# EAGLE design MainBoard_v2.0_RevB (EAGLE 8.4.1)
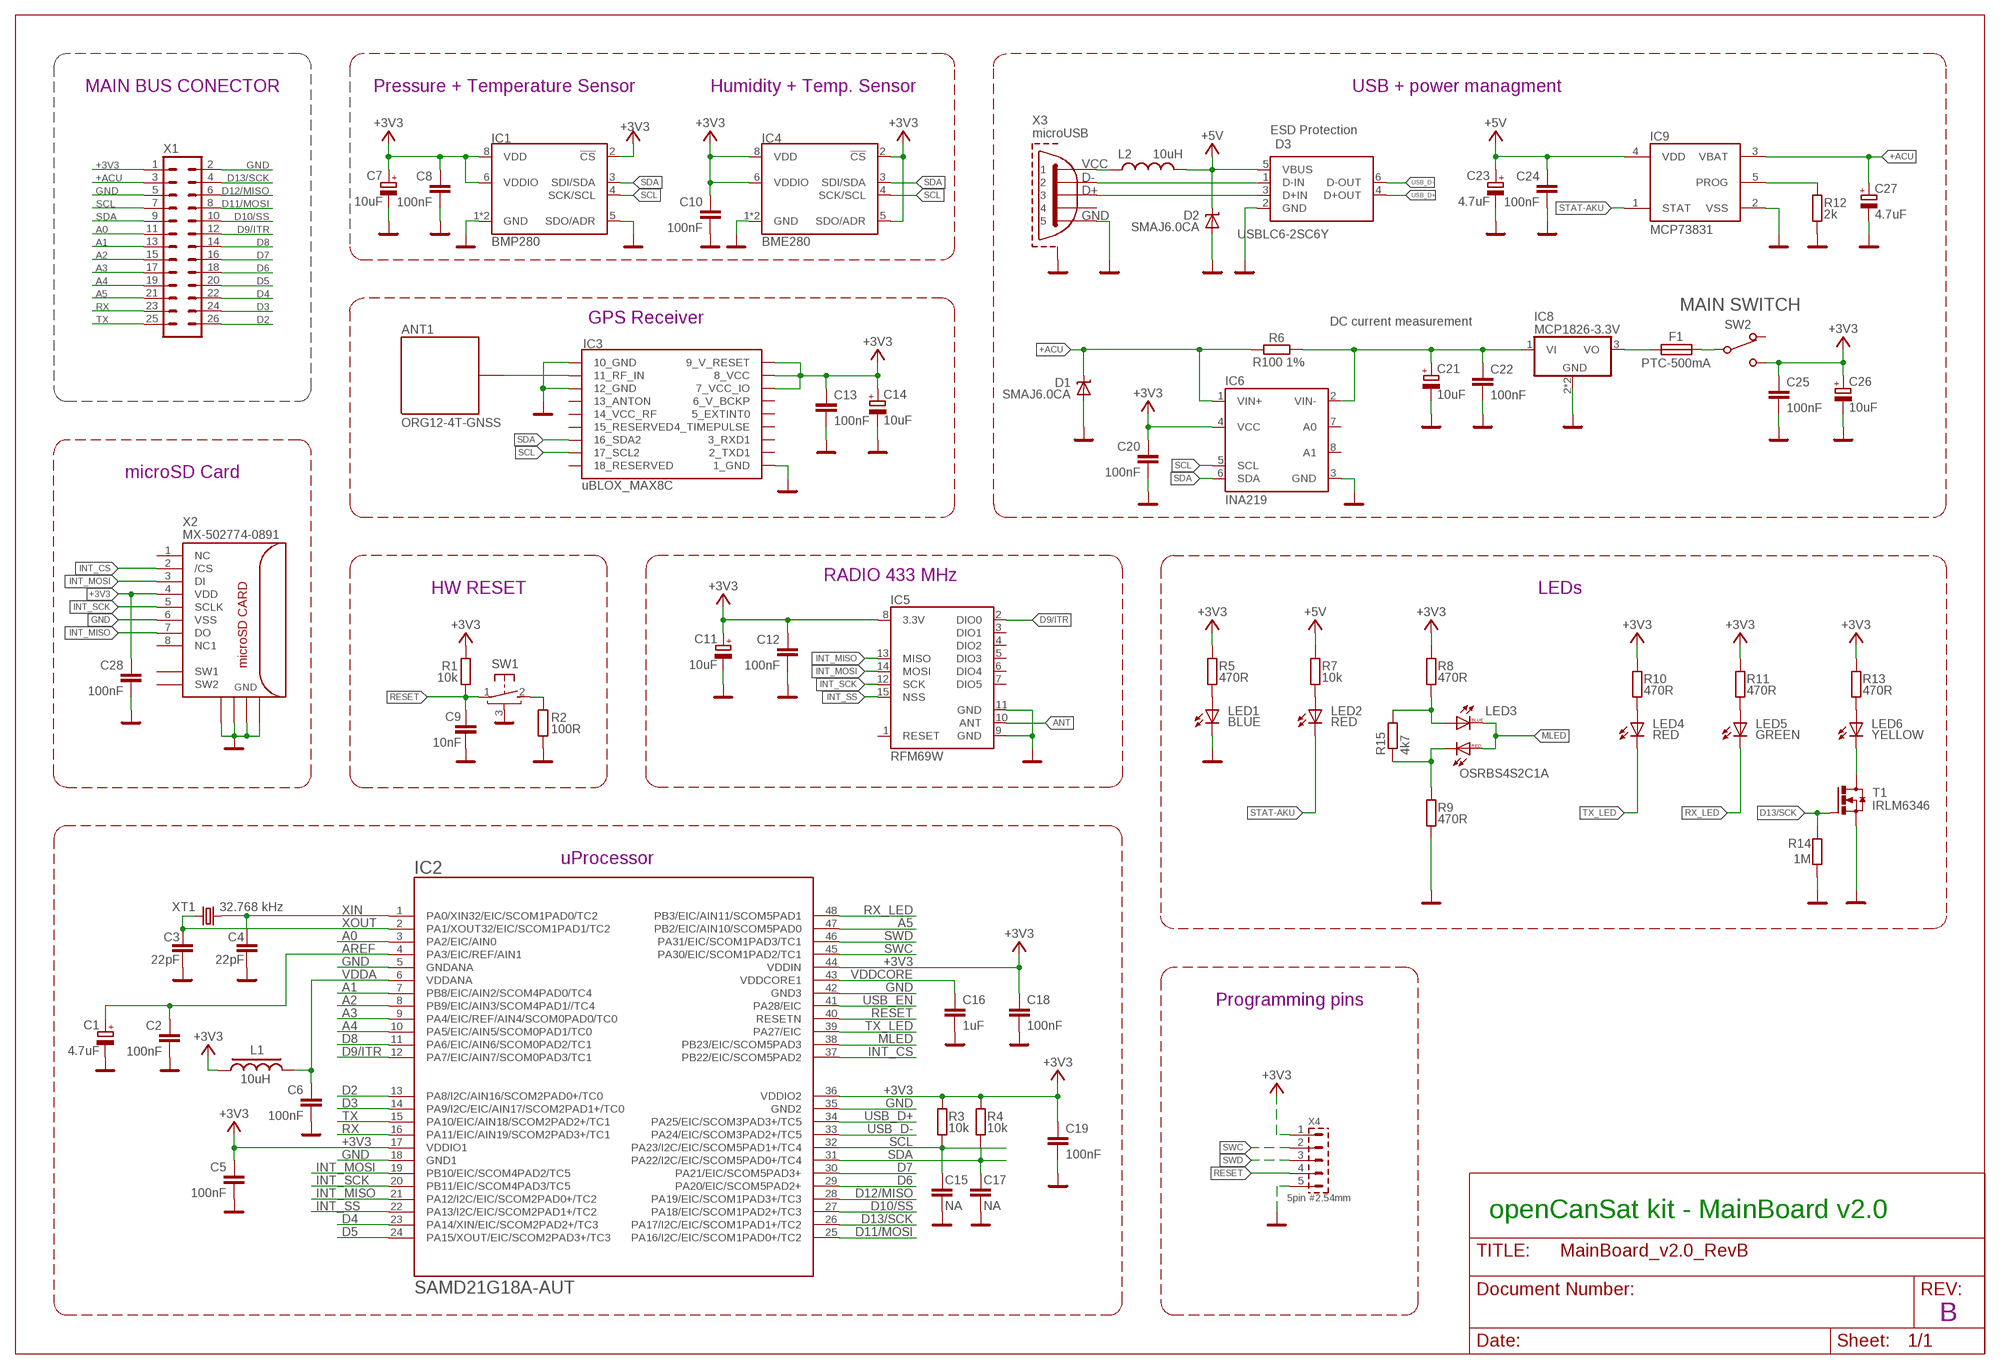
[diagram p0: schematic, sheet 1]

## Parts
ANT1  ORG12-4T-GNSS  GPS_ANT  [ANT_GPS_12X12]
C1  4.7uF  CPOL-EUSMCA  [SMC_A]
C2  100nF  C-EUC0603  [C0603]
C3  22pF  C-EUC0603  [C0603]
C4  22pF  C-EUC0603  [C0603]
C5  100nF  C-EUC0603  [C0603]
C6  100nF  C-EUC0603  [C0603]
C7  10uF  CPOL-EUSMCA  [SMC_A]
C8  100nF  C-EUC0603  [C0603]
C9  10nF  C-EUC0603  [C0603]
C10  100nF  C-EUC0603  [C0603]
C11  10uF  CPOL-EUSMCA  [SMC_A]
C12  100nF  C-EUC0603  [C0603]
C13  100nF  C-EUC0603  [C0603]
C14  10uF  CPOL-EUSMCA  [SMC_A]
C15  NA  C-EUC0603  [C0603]
C16  1uF  C-EUC0805  [C0805]
C17  NA  C-EUC0603  [C0603]
C18  100nF  C-EUC0603  [C0603]
C19  100nF  C-EUC0603  [C0603]
C20  100nF  C-EUC0603  [C0603]
C21  10uF  CPOL-EUSMCB  [SMC_B]
C22  100nF  C-EUC0603  [C0603]
C23  4.7uF  CPOL-EUSMCA  [SMC_A]
C24  100nF  C-EUC0603  [C0603]
C25  100nF  C-EUC0603  [C0603]
C26  10uF  CPOL-EUSMCB  [SMC_B]
C27  4.7uF  CPOL-EUSMCA  [SMC_A]
C28  100nF  C-EUC0603  [C0603]
D1  SMAJ6.0CA  TRANSILDO214AC  [DO214AC]
D2  SMAJ6.0CA  TRANSILDO214AC  [DO214AC]
D3  USBLC6-2SC6Y  [SOT95P280X145-6N]
F1  PTC-500mA  FUZE1210  [1210]
IC1  BMP280  BME280  [LGA-8-2.5X2.5]
IC2  SAMD21G18A-AUT  1792_SAMD21G18A-AUT  [TQFP48-7X7]
IC3  uBLOX_MAX8C  UBLOX_MAX-6  [UBLOX_MAX-6]
IC4  BME280  [LGA-8-2.5X2.5]
IC5  RFM69W  RFM69HW  [RFM69W-XXXS2]
IC6  INA219  [SOT23-8]
IC8  MCP1826-3.3V  MCP1826SOT223-3  [SOT223-3]
IC9  MCP73831  MCP73831/OT  [SOT23-5L]
L1  10uH  L-USL0805  [R0805]
L2  10uH  L-USL0805  [R0805]
LED1  BLUE  LEDCHIPLED_0603  [CHIPLED_0603]
LED2  RED  LEDCHIPLED_0603  [CHIPLED_0603]
LED3  OSRBS4S2C1A  [PLCC4]
LED4  RED  LEDCHIPLED_0603  [CHIPLED_0603]
LED5  GREEN  LEDCHIPLED_0603  [CHIPLED_0603]
LED6  YELLOW  LEDCHIPLED_0603  [CHIPLED_0603]
R1  10k  R-EU_R0603  [R0603]
R2  100R  R-EU_R0603  [R0603]
R3  10k  R-EU_R0603  [R0603]
R4  10k  R-EU_R0603  [R0603]
R5  470R  R-EU_R0603  [R0603]
R6  R100 1%  R-EU_R2010  [R2010]
R7  10k  R-EU_R0603  [R0603]
R8  470R  R-EU_R0603  [R0603]
R9  470R  R-EU_R0603  [R0603]
R10  470R  R-EU_R0603  [R0603]
R11  470R  R-EU_R0603  [R0603]
R12  2k  R-EU_R0603  [R0603]
R13  470R  R-EU_R0603  [R0603]
R14  1M  R-EU_R0603  [R0603]
R15  4k7  R-EU_R0603  [R0603]
SW1  B3U-3100P  [B3U-3100PM]
SW2  MSS-1290  [MSS-1290]
T1  IRLM6346  IRLML6346  [SOT23]
X1  MA13-2SMD  [MA13-2]
X2  MX-502774-0891  MICROSD  [502774-0891]
X3  microUSB  MICROUSB1981568  [1981568-MICROUSB]
X4  5pin #2.54mm  S1G5_JUMPSMD  [PIN5]
XT1  32.768 kHz  XTAL32KHZ  [XTAL35X15]

## Nets
3V31: F1.P$1 IC8.3(VO)
3V32: F1.P$2 SW2.2(2-COM)
+3V3: C5.1 C7.+ C8.1 C10.1 C11.+ C12.1 C13.1 C14.+ C18.1 C19.1 C20.1 C25.1 C26.+ C28.1 IC1.2(!CS) IC1.6(VDDIO) IC1.8(VDD) IC2.17(VDDIO1) IC2.36(VDDIO2) IC2.44(VDDIN) IC3.7_VCC_IO IC3.8_VCC IC3.9_V_RESET IC4.2(!CS) IC4.5(SDO/ADR) IC4.6(VDDIO) IC4.8(VDD) IC5.8(3.3V) IC6.4(VCC) L1.1 R1.2 R3.2 R4.2 R5.2 R8.2 R10.2 R11.2 R13.2 SW2.1(1-NO) X1.1 X2.4(VDD) X4.1
+5V: C23.+ C24.1 D2.C D3.5(VBUS) IC9.4(VDD) L2.2 R7.2
+ACU: C27.+ D1.C IC6.1(VIN+) IC9.3(VBAT) R6.1 X1.3
+VUSB: L2.1 X3.P$1
A0: IC2.3(PA2/EIC/AIN0) X1.11
A1: IC2.7(PB8/EIC/AIN2/SCOM4PAD0/TC4) X1.13
A2: IC2.8(PB9/EIC/AIN3/SCOM4PAD1//TC4) X1.15
A3: IC2.9(PA4/EIC/REF/AIN4/SCOM0PAD0/TC0) X1.17
A4: IC2.10(PA5/EIC/AIN5/SCOM0PAD1/TC0) X1.19
A5: IC2.47(PB2/EIC/AIN10/SCOM5PAD0) X1.21
ANT: IC5.10(ANT)
ANT_GPS: ANT1.ANT_GPS IC3.11_RF_IN
AREF: C1.+ C2.1 IC2.4(PA3/EIC/REF/AIN1)
D2: IC2.13(PA8/I2C/AIN16/SCOM2PAD0+/TC0) X1.26
D3: IC2.14(PA9/I2C/EIC/AIN17/SCOM2PAD1+/TC0) X1.24
D4: IC2.23(PA14/XIN/EIC/SCOM2PAD2+/TC3) X1.22
D5: IC2.24(PA15/XOUT/EIC/SCOM2PAD3+/TC3) X1.20
D6: IC2.29(PA20/EIC/SCOM5PAD2+) X1.18
D7: IC2.30(PA21/EIC/SCOM5PAD3+) X1.16
D8: IC2.11(PA6/EIC/AIN6/SCOM0PAD2/TC1) X1.14
D9/ITR: IC2.12(PA7/EIC/AIN7/SCOM0PAD3/TC1) IC5.2(DIO0) X1.12
D10/SS: IC2.27(PA18/EIC/SCOM1PAD2+/TC3) X1.10
D11/MOSI: IC2.25(PA16/I2C/EIC/SCOM1PAD0+/TC2) X1.8
D12/MISO: IC2.28(PA19/EIC/SCOM1PAD3+/TC3) X1.6
D13/SCK: IC2.26(PA17/I2C/EIC/SCOM1PAD1+/TC2) R14.2 T1.1(G) X1.4
D+IN: D3.3(D+IN) X3.P$3
D-IN: D3.1(D-IN) X3.P$2
GND: C1.- C2.2 C3.2 C4.2 C5.2 C6.2 C7.- C8.2 C9.2 C10.2 C11.- C12.2 C13.2 C14.- C15.2 C16.2 C17.2 C18.2 C19.2 C20.2 C21.- C22.2 C23.- C24.2 C25.2 C26.- C27.- C28.2 D1.A D2.A D3.2(GND) IC1.1(GND) IC1.5(SDO/ADR) IC1.7(GND) IC2.5(GNDANA) IC2.18(GND1) IC2.35(GND2) IC2.42(GND3) IC3.1_GND IC3.10_GND IC3.12_GND IC4.1(GND) IC4.7(GND) IC5.9(GND) IC5.11(GND) IC6.3(GND) IC8.2(GND) IC8.4(GND) IC9.2(VSS) LED1.C R2.1 R9.1 R12.1 R14.1 SW1.3 T1.2(S) X1.2 X1.5 X2.6(VSS) X2.GND1 X2.GND2 X2.GND3 X2.GND4 X3.P$5 X3.P$6(SHIELD) X3.P$7(SHIELD) X3.P$8(SHIELD) X3.P$9(SHIELD) X3.P$10(SHIELD) X3.P$11(SHIELD) X4.5
INT_CS: IC2.37(PB22/EIC/SCOM5PAD2) X2.2(/CS)
INT_MISO: IC2.21(PA12/I2C/EIC/SCOM2PAD0+/TC2) IC5.13(MISO) X2.7(DO)
INT_MOSI: IC2.19(PB10/EIC/SCOM4PAD2/TC5) IC5.14(MOSI) X2.3(DI)
INT_SCK: IC2.20(PB11/EIC/SCOM4PAD3/TC5) IC5.12(SCK) X2.5(SCLK)
INT_SS: IC2.22(PA13/I2C/EIC/SCOM2PAD1+/TC2) IC5.15(NSS)
MLED: IC2.38(PB23/EIC/SCOM5PAD3) LED3.3(C-B) LED3.4(A-R)
N$1: LED4.A R10.1
N$2: LED5.A R11.1
N$3: LED6.A R13.1
N$5: LED6.C T1.3(D)
N$6: R2.2 SW1.2(S)
N$7: LED3.2(A-B) R8.1 R15.2
N$9: LED3.1(C-R) R9.2 R15.1
N$11: LED2.A R7.1
N$13: LED1.A R5.1
N$14: C21.+ C22.1 IC6.2(VIN-) IC8.1(VI) R6.2
N$16: IC9.5(PROG) R12.2
RESET: C9.1 IC2.40(RESETN) R1.1 SW1.1(P) X4.4
RX: IC2.16(PA11/EIC/AIN19/SCOM2PAD3+/TC1) X1.23
RX_LED: IC2.48(PB3/EIC/AIN11/SCOM5PAD1) LED5.C
SCL: C15.1 IC1.4(SCK/SCL) IC2.32(PA23/I2C/EIC/SCOM5PAD1+/TC4) IC3.17_SCL2 IC4.4(SCK/SCL) IC6.5(SCL) R3.1 X1.7
SDA: C17.1 IC1.3(SDI/SDA) IC2.31(PA22/I2C/EIC/SCOM5PAD0+/TC4) IC3.16_SDA2 IC4.3(SDI/SDA) IC6.6(SDA) R4.1 X1.9
STAT-AKU: IC9.1(STAT) LED2.C
SWC: IC2.45(PA30/EIC/SCOM1PAD2/TC1) X4.2
SWD: IC2.46(PA31/EIC/SCOM1PAD3/TC1) X4.3
TX: IC2.15(PA10/EIC/AIN18/SCOM2PAD2+/TC1) X1.25
TX_LED: IC2.39(PA27/EIC) LED4.C
USB_D+: D3.4(D+OUT) IC2.34(PA25/EIC/SCOM3PAD3+/TC5)
USB_D-: D3.6(D-OUT) IC2.33(PA24/EIC/SCOM3PAD2+/TC5)
USB_EN: IC2.41(PA28/EIC)
VDDA: C6.1 IC2.6(VDDANA) L1.2
VDDCORE: C16.1 IC2.43(VDDCORE1)
XIN: C4.1 IC2.1(PA0/XIN32/EIC/SCOM1PAD0/TC2) XT1.2
XOUT: C3.1 IC2.2(PA1/XOUT32/EIC/SCOM1PAD1/TC2) XT1.1
Unconnected: IC3.2_TXD1 IC3.3_RXD1 IC3.4_TIMEPULSE IC3.5_EXTINT0 IC3.6_V_BCKP IC3.13_ANTON IC3.14_VCC_RF IC3.15_RESERVED IC3.18_RESERVED IC5.1(RESET) IC5.3(DIO1) IC5.4(DIO2) IC5.5(DIO3) IC5.6(DIO4) IC5.7(DIO5) IC6.7(A0) IC6.8(A1) SW2.3(3-NC) X2.1(NC) X2.8(NC1) X2.SW1 X2.SW2 X3.P$4

## Notes on the sheet
- MAIN BUS CONECTOR | Pressure + Temperature Sensor | Humidity + Temp. Sensor | USB + power managment
- ESD Protection
- MAIN SWITCH
- GPS Receiver | DC current measurement
- microSD Card
- RADIO 433 MHz
- HW RESET | LEDs
- uProcessor
- Programming pins
- openCanSat kit - MainBoard v2.0
- B

## Library data of the parts
ANT1 = #my:GPS_ANT
C1 C7 C11 C14 C21 C23 C26 C27 = rcl:CPOL-EU: POLARIZED CAPACITOR, European symbol
C2-C6 C8-C10 C12 C13 C15-C20 C22 C24 C25 C28 = rcl:C-EU: CAPACITOR, European symbol
D1 D2 = #Marek:TRANSIL: TRANSIL
D3 = USBLC6-2SC6Y:USBLC6-2SC6Y: Low Cap. ESD Protection Auto SOT-23-6 STMicroelectronics USBLC6-2SC6Y, Dual Uni-Directional TVS Diode Array, 6-Pin SOT-23 <https://componentsearchengine.com/Images/1/USBLC6-2SC6Y.jpg> Source: Datasheet <https://componentsearchengine.com/Datasheets/1/USBLC6-2SC6Y.pdf>; DESCRIPTION: Low Cap. ESD Protection Auto SOT-23-6 STMicroelectronics USBLC6-2SC6Y, Dual Uni-Directional TVS Diode Array, 6-Pin SOT-23; HEIGHT: 1.45mm; MANUFACTURER_NAME: STMicroelectronics; MANUFACTURER_PART_NUMBER: USBLC6-2SC6Y; RS_PART_NUMBER: 8805525; SUPPLIER_NAME: RS
F1 = #littlefuse:FUZE1210: KufMic
IC1 = SparkFun-Sensors:BME280: Bosch BME280 – Combined Humidity and Pressure Sensor The BME280 is as combined digital humidity, pressure and temperature sensor based on proven sensing principles. The sensor module is housed in an extremely compact metal-lid LGA package with a footprint of only 2.5×2.5mm² with a height of 0.93mm. Its small dimensions and its low power consumption allow the implementation in battery driven devices such as handsets, GPS modules or watches. Datasheet <https://cdn.sparkfun.com/assets/learn_tutorials/4/1/9/BST-BME280_DS001-10.pdf> SparkFun Products SparkFun Atmospheric Sensor Breakout - BME280 <https://www.sparkfun.com/products/13676> (SEN-13676); PROD_ID: IC-13090; VALUE: BME280
IC2 = IntegratedCircuits:1792_SAMD21G18A-AUT: Atmel D21 32bit ARM Cortex-M0 microcontroller - 48 PIN TQFP 256KB flash memory + 32KB SRAM
IC3 = ava:UBLOX_MAX-6: UBLOX MAX-6
IC4 = SparkFun-Sensors:BME280: Bosch BME280 – Combined Humidity and Pressure Sensor The BME280 is as combined digital humidity, pressure and temperature sensor based on proven sensing principles. The sensor module is housed in an extremely compact metal-lid LGA package with a footprint of only 2.5×2.5mm² with a height of 0.93mm. Its small dimensions and its low power consumption allow the implementation in battery driven devices such as handsets, GPS modules or watches. Datasheet <https://cdn.sparkfun.com/assets/learn_tutorials/4/1/9/BST-BME280_DS001-10.pdf> SparkFun Products SparkFun Atmospheric Sensor Breakout - BME280 <https://www.sparkfun.com/products/13676> (SEN-13676); PROD_ID: IC-13090
IC5 = SparkFun-RF:RFM69H: Hope RF RFM69H ISM Transceiver Module The RFM69H is a transceiver module capable of operation over a wide frequency range, including the 315,433,868 and 915MHz license-free ISM (Industry Scientific and Medical) frequency bands. All major RF communication parameters are programmable and most of them can be dynamically set. The RFM69H offers the unique advantage of programmable narrow-band and wide- band communication modes. The RFM69H is optimized for low power consumption while offering high RF output power and channelized operation.Compliance ETSI and FCC regulations. Datasheet <http://www.hoperf.cn/upload/docs/RF/SX/RFM69H_DataSheet_v1.3.pdf> SparkFun Products RFM69HCW Wireless Transceiver - 915MHz <https://www.sparkfun.com/products/13909> (COM-13909) RFM69HCW Wireless Transceiver - 434MHz <https://www.sparkfun.com/products/13910> (COM-13910) SparkFun RFM69 Breakout (915MHz) <https://www.sparkfun.com/products/12775> (WRL-12775) SparkFun RFM69 Breakout (434MHz) <https://www.sparkfun.com/products/12823> (WRL-12823)
IC6 = #my:INA219
IC8 = #Microchip:MCP1826
IC9 = adafruit:MCP73831: MCP73831/2 Miniature Single-Cell, Fully Integrated Li-Ion, Li-Polymer Charge Management Controllers. Nice and small simple lipoly charge controller, with adjustable current and status output (LED) http://www.ladyada.net/library/pcb/eaglelibrary.html
L1 L2 = rcl:L-US: INDUCTOR, American symbol
LED1 LED2 LED4-LED6 = led:LED: LED OSRAM: - CHIPLED LG R971, LG N971, LY N971, LG Q971, LY Q971, LO R971, LY R971 LH N974, LH R974 LS Q976, LO Q976, LY Q976 LO Q996 - Hyper CHIPLED LW Q18S LB Q993, LB Q99A, LB R99A - SideLED LS A670, LO A670, LY A670, LG A670, LP A670 LB A673, LV A673, LT A673, LW A673 LH A674 LY A675 LS A676, LA A676, LO A676, LY A676, LW A676 LS A679, LY A679, LG A679 - Hyper Micro SIDELED® LS Y876, LA Y876, LO Y876, LY Y876 LT Y87S - SmartLED LW L88C, LW L88S LB L89C, LB L89S, LG L890 LS L89K, LO L89K, LY L89K LS L896, LA L896, LO L896, LY L896 - TOPLED LS T670, LO T670, LY T670, LG T670, LP T670 LSG T670, LSP T670, LSY T670, LOP T670, LYG T670 LG T671, LOG T671, LSG T671 LB T673, LV T673, LT T673, LW T673 LH T674 LS T676, LA T676, LO T676, LY T676, LB T676, LH T676, LSB T676, LW T676 LB T67C, LV T67C, LT T67C, LS T67K, LO T67K, LY T67K, LW E67C LS E67B, LA E67B, LO E67B, LY E67B, LB E67C, LV E67C, LT E67C LW T67C LS T679, LY T679, LG T679 LS T770, LO T770, LY T770, LG T770, LP T770 LB T773, LV T773, LT T773, LW T773 LH T774 LS E675, LA E675, LY E675, LS T675 LS T776, LA T776, LO T776, LY T776, LB T776 LHGB T686 LT T68C, LB T68C - Hyper Mini TOPLED® LB M676 - Mini TOPLED Santana® LG M470 LS M47K, LO M47K, LY M47K Source: http://www.osram.convergy.de LUXEON: - LUMILED® LXK2-PW12-R00, LXK2-PW12-S00, LXK2-PW14-U00, LXK2-PW14-V00 LXK2-PM12-R00, LXK2-PM12-S00, LXK2-PM14-U00 LXK2-PE12-Q00, LXK2-PE12-R00, LXK2-PE12-S00, LXK2-PE14-T00, LXK2-PE14-U00 LXK2-PB12-K00, LXK2-PB12-L00, LXK2-PB12-M00, LXK2-PB14-N00, LXK2-PB14-P00, LXK2-PB14-Q00 LXK2-PR12-L00, LXK2-PR12-M00, LXK2-PR14-Q00, LXK2-PR14-R00 LXK2-PD12-Q00, LXK2-PD12-R00, LXK2-PD12-S00 LXK2-PH12-R00, LXK2-PH12-S00 LXK2-PL12-P00, LXK2-PL12-Q00, LXK2-PL12-R00 Source: www.luxeon.com KINGBRIGHT: KA-3528ASYC Source: www.kingbright.com
LED3 = led:OSRBS4S2C1A
R1-R15 = rcl:R-EU_: RESISTOR, European symbol
SW1 = #my:B3U-3100P
SW2 = #PaJa_prepinace:MSS-1290: MSS-1290BN (TME)
T1 = #my:IRLML6346
X1 = #my:MA13-2
X2 = con-molex-microsd:MICROSD
X3 = #Marek:MICROUSB
X4 = #PaJa_konektory:S1G5_JUMP: Radove konektory - koliky - 5x
XT1 = #my:XTAL32KHZ

## Net classes
1 USB: width 0.203 mm, drill 0.305 mm, clearance 0.178 mm
2 gnd: width 0.254 mm, drill 0.254 mm, clearance 0.178 mm
3 usbvcc: width 0.203 mm, drill 0.406 mm, clearance 0.178 mm
4 USBpair: width 0.254 mm, drill 0.406 mm, clearance 0.406 mm

## Board
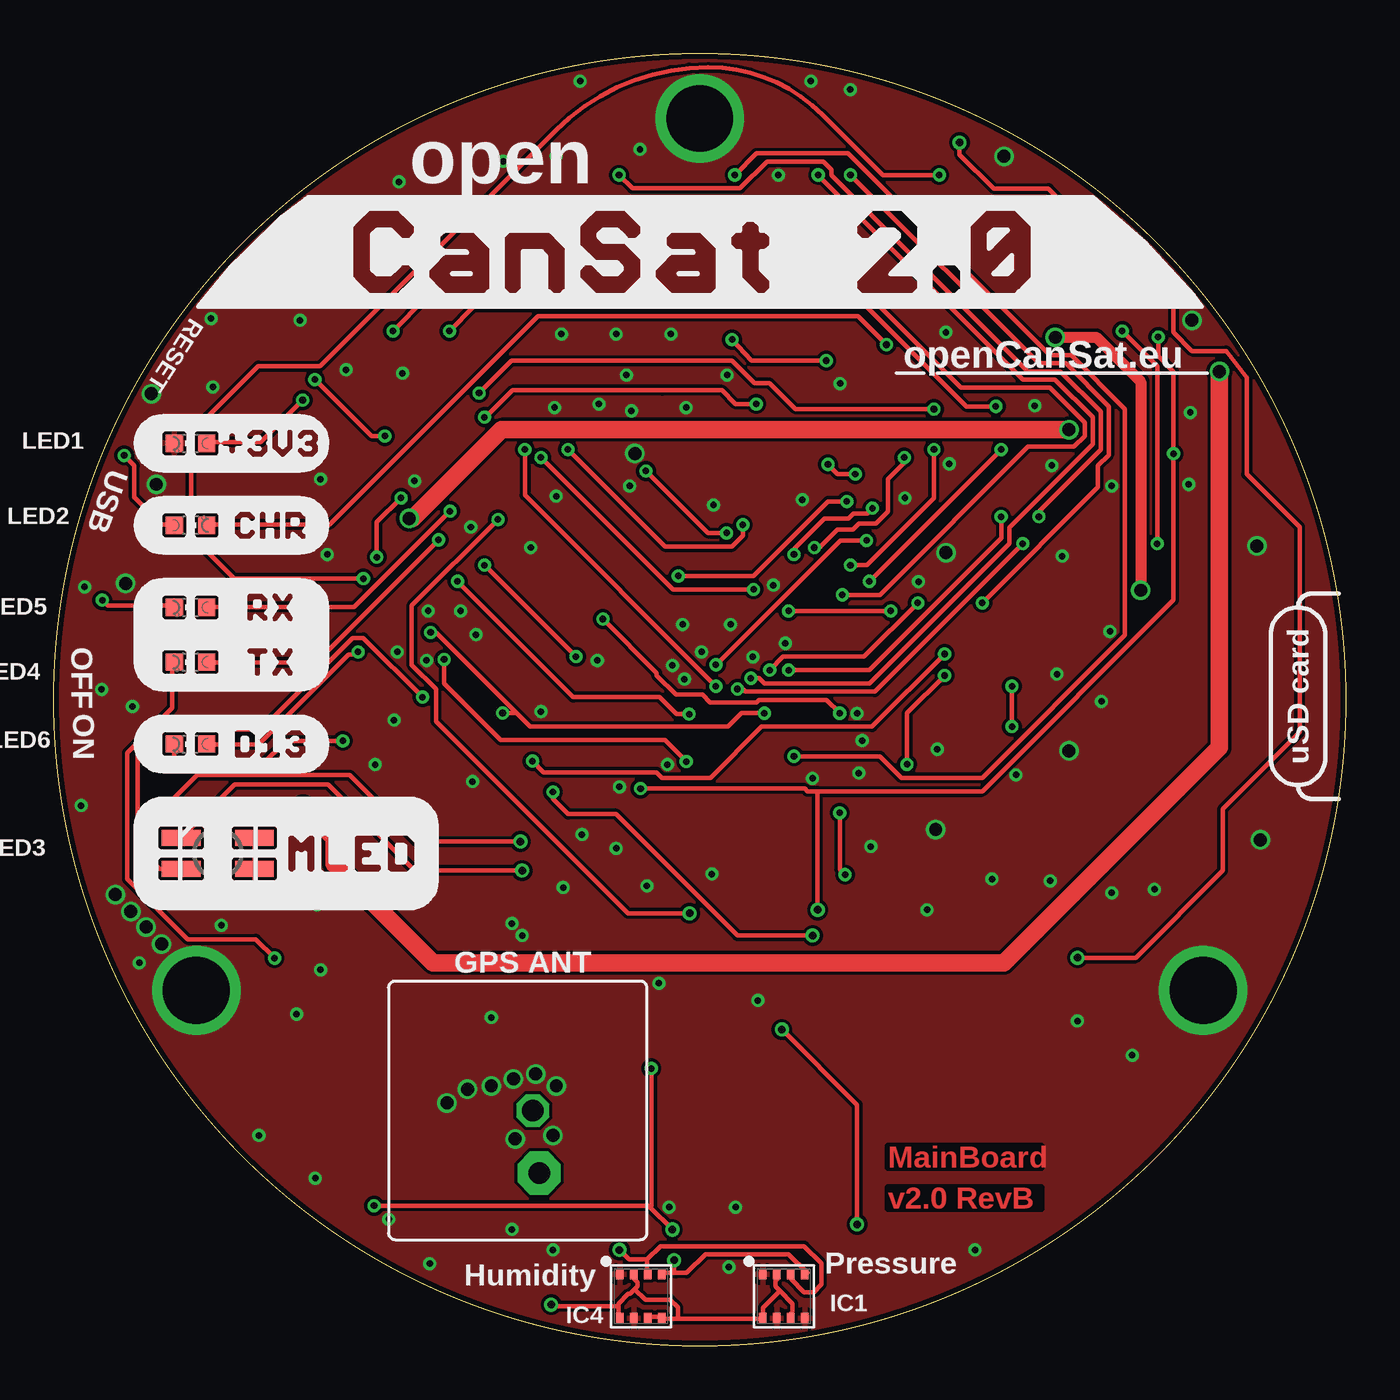
[diagram p1: board, top side]
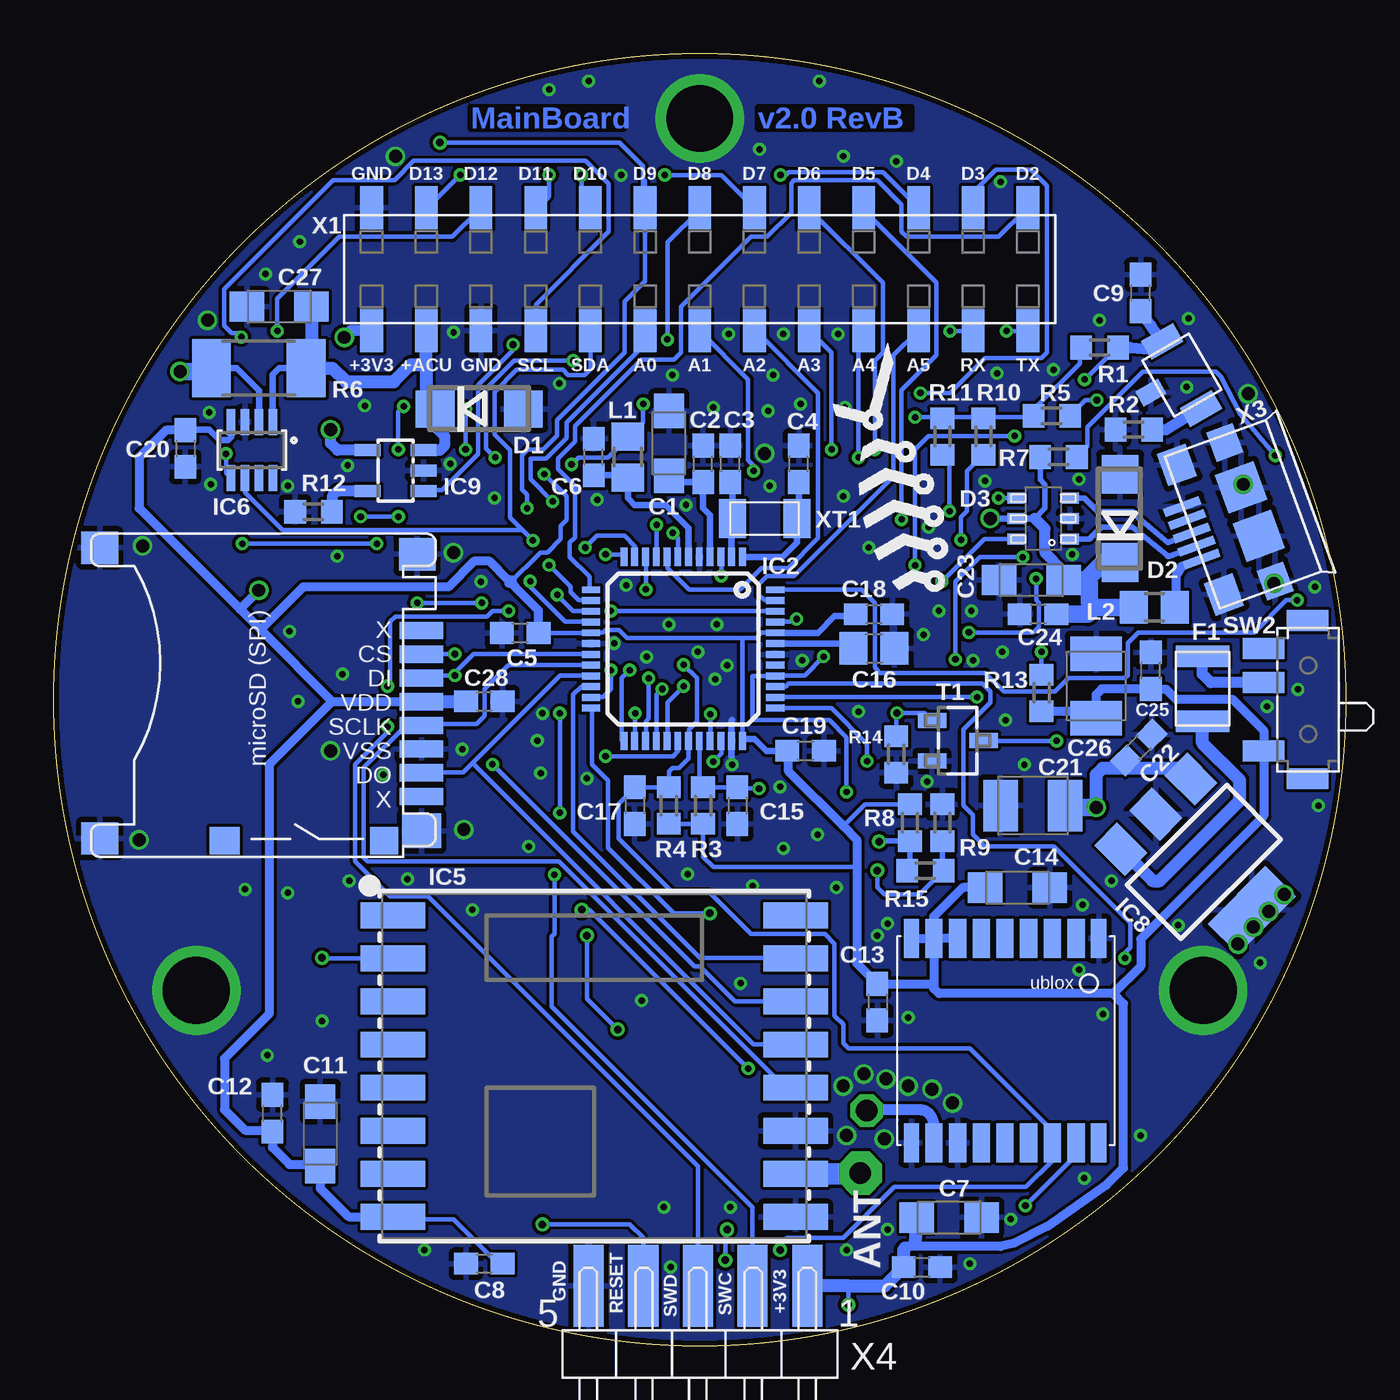
[diagram p2: board, bottom side, seen from below]

Size 60 x 60 mm. Coordinates in mm from the lower left corner, seen from the top.
Outline: circle at 30,30 radius 30
Copper layers (1*16): Top 0.035mm / dielectric 1.5mm / Bottom 0.035mm
Design rules "SeeedStudio_2layer_DRU_no_angle_20140221 *": minimum track width 8mil, minimum drill 0.3mm, track to track 6mil, track to pad 6mil, pad to pad 6mil, via to via 6mil, smd to smd 0mil, copper to edge 10mil, drill to drill 10mil, minimum pad ring 10mil, minimum via ring 6mil, stop-mask expansion 2mil, vias tented up to drill 100mil, thermal gap 10mil
vRestrict: area 4.4,47.6 to 55.2,54; area 3.5,40.3 to 13,43.5; area 3.5,36.5 to 13,39.7; area 3.5,30.2 to 13,35.9; area 3.5,26.4 to 13,29.5; area 3.5,20 to 18.1,25.7

### Footprints (pad centres in the part's own frame; a part is rotated, then mirrored left to right if it is on the bottom)
ANT_GPS_12X12 = drill 1 octagon: ANT_GPS 0,-0.7
SMC_A = smd 1.6 x 1.4: + -1.5,0; - 1.5,0
C0603 = smd 1.1 x 1: 1 -0.85,0; 2 0.85,0
C0805 = smd 1.3 x 1.5: 1 -0.95,0; 2 0.95,0
SMC_B = smd 1.6 x 2.4: + -1.5,0; - 1.5,0
DO214AC = smd 1.8 x 1.7: A 2.05,0; C -2.05,0
SOT95P280X145-6N = smd 0.813 x 0.508: 1 -1.25,0.95; 2 -1.25,0; 3 -1.25,-0.95; 4 1.25,-0.95; 5 1.25,0; 6 1.25,0.95
1210 = smd 1 x 2.5: P$1 -1.47,-0.02; P$2 1.53,-0.02
LGA-8-2.5X2.5 = smd 0.35 x 0.5: 1 -0.975,1.025; 2 -0.325,1.025; 3 0.325,1.025; 4 0.975,1.025; 5 0.975,-1.025; 6 0.325,-1.025; 7 -0.325,-1.025; 8 -0.975,-1.025
TQFP48-7X7 = smd 0.85 x 0.32: 1 -4.275,2.75; 2 -4.275,2.25; 3 -4.275,1.75; 4 -4.275,1.25; 5 -4.275,0.75; 6 -4.275,0.25; 7 -4.275,-0.25; 8 -4.275,-0.75; 9 -4.275,-1.25; 10 -4.275,-1.75; 11 -4.275,-2.25; 12 -4.275,-2.75; 25 4.275,-2.75; 26 4.275,-2.25; 27 4.275,-1.75; 28 4.275,-1.25; 29 4.275,-0.75; 30 4.275,-0.25; 31 4.275,0.25; 32 4.275,0.75; 33 4.275,1.25; 34 4.275,1.75; 35 4.275,2.25; 36 4.275,2.75 | smd 0.32 x 0.85: 13 -2.75,-4.275; 14 -2.25,-4.275; 15 -1.75,-4.275; 16 -1.25,-4.275; 17 -0.75,-4.275; 18 -0.25,-4.275; 19 0.25,-4.275; 20 0.75,-4.275; 21 1.25,-4.275; 22 1.75,-4.275; 23 2.25,-4.275; 24 2.75,-4.275; 37 2.75,4.275; 38 2.25,4.275; 39 1.75,4.275; 40 1.25,4.275; 41 0.75,4.275; 42 0.25,4.275; 43 -0.25,4.275; 44 -0.75,4.275; 45 -1.25,4.275; 46 -1.75,4.275; 47 -2.25,4.275; 48 -2.75,4.275
UBLOX_MAX-6 = smd 1.8 x 0.7: 1_GND 4.95,-4.4; 9_V_RESET 4.95,4.3; 10_GND -4.55,4.3; 18_RESERVED -4.55,-4.4 | smd 1.8 x 0.8: 2_TXD1 4.95,-3.35; 3_RXD1 4.95,-2.25; 4_TIMEPULSE 4.95,-1.15; 5_EXTINT0 4.95,-0.05; 6_V_BCKP 4.95,1.05; 7_VCC_IO 4.95,2.15; 8_VCC 4.95,3.25; 11_RF_IN -4.55,3.25; 12_GND -4.55,2.15; 13_ANTON -4.55,1.05; 14_VCC_RF -4.55,-0.05; 15_RESERVED -4.55,-1.15; 16_SDA2 -4.55,-2.25; 17_SCL2 -4.55,-3.35
RFM69W-XXXS2 = smd 3 x 1.2: 1 -9.35,7; 2 -9.35,5; 3 -9.35,3; 4 -9.35,1; 5 -9.35,-1; 6 -9.35,-3; 7 -9.35,-5; 8 -9.35,-7; 9 9.35,-7; 10 9.35,-5; 11 9.35,-3; 12 9.35,-1; 13 9.35,1; 14 9.35,3; 15 9.35,5; 16 9.35,7
SOT23-8 = smd 0.4 x 1.2: 1 -0.975,-1.3; 2 -0.325,-1.3; 3 0.325,-1.3; 4 0.975,-1.3; 5 0.975,1.3; 6 0.325,1.3; 7 -0.325,1.3; 8 -0.975,1.3
SOT223-3 = smd 1.5 x 2: 1 -2.3,-3.15; 2 0,-3.15; 3 2.3,-3.15 | smd 3.8 x 2: 4 0,3.15
SOT23-5L = smd 0.55 x 1.2: 1 -0.95,-1.3; 2 0,-1.3; 3 0.95,-1.3; 4 0.95,1.3; 5 -0.95,1.3
R0805 = smd 1.3 x 1.5: 1 -0.95,0; 2 0.95,0
CHIPLED_0603 = smd 0.8 x 0.8: A 0,-0.75; C 0,0.75
PLCC4 = smd 0.75 x 1.8: 1 0.725,1.7; 2 -0.725,1.7; 3 -0.725,-1.7; 4 0.725,-1.7
R0603 = smd 1 x 1.1: 1 -0.85,0; 2 0.85,0
R2010 = smd 1.8 x 2.7: 1 -2.2,0; 2 2.2,0
B3U-3100PM = smd 1 x 1.7: 1 -1.8,0; 2 1.8,0 | smd 0.8 x 1.2: 3 0,-1.65
MSS-1290 = smd 0.965 x 1.93: 1 -2.223,1.905; 2 0.953,1.905; 3 2.54,1.905; 4 3.838,-0.127; 5 -3.512,-0.127
SOT23 = smd 0.7 x 1.321: 1 -0.94,-1.194; 2 0.94,-1.194; 3 0,1.194
MA13-2 = smd 1.05 x 2: 1 -15.24,-2.85; 2 -15.24,2.85; 3 -12.7,-2.85; 4 -12.7,2.85; 5 -10.16,-2.85; 6 -10.16,2.85; 7 -7.62,-2.85; 8 -7.62,2.85; 9 -5.08,-2.85; 10 -5.08,2.85; 11 -2.54,-2.85; 12 -2.54,2.85; 13 0,-2.85; 14 0,2.85; 15 2.54,-2.85; 16 2.54,2.85; 17 5.08,-2.85; 18 5.08,2.85; 19 7.62,-2.85; 20 7.62,2.85; 21 10.16,-2.85; 22 10.16,2.85; 23 12.7,-2.85; 24 12.7,2.85; 25 15.24,-2.85; 26 15.24,2.85
502774-0891 = smd 0.8 x 2: 1 0,0.66; 2 -1.1,0.66; 3 -2.2,0.66; 4 -3.3,0.66; 5 -4.4,0.66; 6 -5.5,0.66; 7 -6.6,0.66; 8 -7.7,0.66 | smd 1.6 x 1.8: GND1 -9.3,0.65 | smd 1.5 x 1.7: GND2 3.55,0.85; GND3 -9.65,15.6; GND4 3.85,15.6 | smd 1.29 x 1.3: SW1 -9.755,2.4 | smd 1.29 x 1.4: SW2 -9.755,9.8
1981568-MICROUSB = smd 0.4 x 1.75: P$1 -1.3,2.875; P$2 -0.65,2.875; P$3 0,2.875; P$4 0.65,2.875; P$5 1.3,2.875 | smd 1.6 x 1.4: P$6 -3.2,2.45; P$7 3.2,2.45 | smd 1.45 x 1.3: P$8 -3.425,0; P$9 3.425,0 | smd 1.9 x 1.9: P$10 -1.2,0; P$11 1.2,0
PIN5 = smd 1.4 x 3.81: 1 -5.08,-1.27; 2 -2.54,-1.27; 3 0,-1.27; 4 2.54,-1.27; 5 5.08,-1.27
XTAL35X15 = smd 1.25 x 1.8: 1 -1.5,0; 2 1.5,0

### Placement (x,y rotation side)
ANT1  21.55,10.93 90 top
C1  31.43,41.91 90 bottom
C2  29.84,40.96 90 bottom
C3  28.57,40.96 90 bottom
C4  25.4,40.96 90 bottom
C5  38.34,33.1 180 bottom
C6  34.92,41.27 90 bottom
C7  18.41,5.95 0 bottom
C8  40.01,3.81 180 bottom
C9  9.53,48.9 90 bottom
C10  19.68,3.65 0 bottom
C11  47.62,9.84 90 bottom
C12  49.85,10.79 90 bottom
C13  21.75,15.95 270 bottom
C14  15.24,21.27 0 bottom
C15  28.26,25.08 270 bottom
C16  21.91,32.38 0 bottom
C17  33.02,25.08 270 bottom
C18  21.91,33.97 0 bottom
C19  25.08,27.62 0 bottom
C20  53.9,41.67 270 bottom
C21  14.53,25.08 180 bottom
C22  9.6,27.78 45 bottom
C23  14.61,35.56 180 bottom
C24  14.29,33.97 180 bottom
C25  9.05,31.35 90 bottom
C26  11.59,30.64 90 bottom
C27  49.53,48.26 180 bottom
C28  40.01,29.92 0 bottom
D1  40.24,43.5 0 bottom
D2  10.48,38.42 90 bottom
D3  14.05,38.42 180 bottom
F1  6.67,30.48 90 bottom
IC1  33.9,2.3 0 top
IC2  30.77,32.36 270 bottom
IC3  15.88,13.97 90 bottom
IC4  27.27,2.3 0 top
IC5  34.9,12.98 0 bottom
IC6  50.8,41.59 180 bottom
IC8  6.59,22.46 225 bottom
IC9  44.13,40.64 90 bottom
L1  33.34,41.27 270 bottom
L2  8.89,34.29 180 bottom
LED1  6.35,41.91 90 top
LED2  6.35,38.1 270 top
LED3  7.62,22.86 90 top
LED4  6.35,31.75 90 top
LED5  6.35,34.29 90 top
LED6  6.35,27.94 90 top
R1  11.43,46.35 180 bottom
R2  9.84,42.55 0 bottom
R3  29.84,25.08 270 bottom
R4  31.43,25.08 270 bottom
R5  13.65,43.18 180 bottom
R6  50.48,45.4 180 bottom
R7  13.34,41.27 180 bottom
R8  20.24,24.29 90 bottom
R9  18.73,24.29 270 bottom
R10  16.83,42.23 90 bottom
R11  18.73,42.23 90 bottom
R12  47.94,38.73 0 bottom
R13  14.13,30.32 270 bottom
R14  20.88,27.46 90 bottom
R15  19.53,22.07 180 bottom
SW1  7.62,45.09 300 bottom
SW2  1.91,29.84 90 bottom
T1  18.02,28.1 270 bottom
U$1  [RYBICKA_12MM]  21.03,39.13 270 bottom
X1  30,50 0 bottom
X2  42.27,33.21 90 bottom
X3  4.45,38.73 110 bottom
X4  30.08,1.51 180 bottom
XT1  26.99,38.42 0 bottom

### Tracks (layer width: path | path; a pad name or v marks a point on that pad's centre or on a via)
3V31
  Bottom 0.61: IC8.3 8.97,21.59 8.65,21.59 4.92,25.32 4.92,26.27 6.65,28 F1.P$1
3V32
  Bottom 0.508: SW2.2 6.27,30.8 6.67,31.19 6.67,31.99 F1.P$2
+3V3  (via drill 0.3, 0.35, 0.6)
  Top 0.203: 26.23,1.83 26.23,1.96 26.67,2.4 26.76,2.4 26.98,2.62 | 26.23,1.83 26.23,1.33 IC4.8 | 26.98,2.62 27.11,2.76 27.11,2.93 26.94,3.11 26.94,3.29 IC4.2 | IC4.6 27.65,1.33 28.18,1.33 IC4.5 28.27,1.25 28.98,1.25 | 28.98,1.25 32.89,1.25 IC1.8 32.93,1.75 33.72,2.55 | 26.98,2.62 27.47,2.13 28.63,2.13 28.98,1.78 28.98,1.25 | v20,43.12 20.06,43.12 21.31,44.38 28.26,44.37 31.04,44.37 31.67,43.74 v32.62,43.74 | 26.23,1.83 23.18,1.83 v23.1,1.91 | v35.95,40.93 36.41,40.48 v37.23,40.48 | 33.72,2.55 33.52,2.76 33.52,3.02 33.6,3.11 33.6,3.29 IC1.2 | 33.72,2.55 34.31,1.96 34.31,1.6 34.23,1.51 34.23,1.33 IC1.6
  Top 0.508: v46.51,46.83 48.42,46.83 50.48,44.77 v50.48,35.08 50.48,34.92
  Bottom 0.203: R4.2 R3.2 29.84,22.7 29.37,22.23 22.7,22.23 | R11.2 18.67,43.12 16.89,43.12 R10.2 16.8,43.12 14.58,43.12 R5.2 14.4,43.2 14.4,43.56 12.36,45.61 12.36,46.32 R1.2 | C8.1 39.2,3.82 39.38,3.82 41.43,5.87 44.09,5.87 IC5.8 | 33.34,42.14 L1.1 | 19.11,43.03 18.76,43.03 R11.2 | 22.67,34.05 C18.1 | C5.1 37.48,33.11 IC2.17 35,33.12 34.5,33.12 34.38,33.25 33.75,33.25 33.38,32.88 28.1,32.88 | IC2.44 26.62,33.12 27.12,33.12 27.38,32.88 28.1,32.88 | L1.1 33.38,42.12 34.25,41.25 35.64,41.25 v35.95,40.93 | 38.73,35.48 38.88,35.38 37.4,36.85 37.08,36.85 36.46,37.47 36.46,38.07 36.2,38.34 36.2,39.45 v37.23,40.48 | 38.73,35.48 38.66,35.4 | 38.73,35.48 38.81,35.48 | v20,43.12 19.12,43.12 R11.2 | v32.62,43.74 32.62,42.88 33.25,42.25 L1.1 | 38.81,35.56 38.86,35.56 38.88,35.54 | R8.2 22.33,25.14 23.34,24.13 | IC2.36 28.02,32.8 28.1,32.88 | v23.1,1.91 23.1,2.78
  Bottom 0.305: C19.1 26.91,27.62 27.46,28.18 27.93,28.18 IC2.36 | IC2.44 24.52,33.11 23.73,33.89 22.84,33.89 C18.1 | C20.1 53.87,42.55 52.78,42.55 52.31,42.07 51.91,42.07 51.77,42.2 IC6.4
  Bottom 0.406: 11.59,29.45 11.59,30.24 11.33,30.5 C25.1 9.03,30.48 8.33,30.48 7.86,30 5.24,30 3.81,28.57 SW2.1 3.81,24.61 9.53,18.89 9.53,17.62 10.79,16.35 | 11.59,29.45 C26.+ | R13.2 11.61,29.47 11.59,29.45 | C14.+ 17.78,21.27 19.12,19.93 IC3.8_VCC | IC3.8_VCC 19.12,16.86 | 19.12,16.86 19.12,16.59 18.89,16.35 10.79,16.35 | IC5.8 46.31,5.99 47.62,7.3 C11.+ 47.7,8.41 49.05,8.41 49.85,9.21 C12.1 49.9,10 51.12,10 52.07,10.95 52.07,13.34 50.01,15.4 50.01,26.99 47.07,29.92 | 47.07,29.92 C28.1 | C20.1 54.79,42.52 56.04,41.27 56.04,38.89 51.36,34.21 | 51.36,34.21 50.4,33.26 | 50.4,33.26 47.07,29.92 | C19.1 25.88,27.57 25.88,26.67 23.34,24.13 22.7,23.5 22.7,22.23 22.7,17.76 C13.1 19.18,16.8 19.12,16.86 | 19.99,4.75 20.54,4.45 20.54,4.6 16.03,4.6 15.4,4.76 13.81,5.56 11.11,7.46 10.32,8.26 10.32,15.88 10.79,16.35 | C5.1 37.49,34.15 38.58,35.24 38.81,35.56 38.73,35.48 | 38.73,35.48 38.73,35.4 38.88,35.42 | 38.73,35.48 38.73,35.56 38.81,35.48 | 38.81,35.48 38.72,35.5 38.73,35.48 | 38.81,35.48 38.88,35.42 | 38.88,35.42 38.73,35.48 | 38.88,35.54 39.77,36.43 40.48,36.43 41.67,35.24 48.42,35.24 50.4,33.26 | v50.48,35.08 51.36,34.21 | IC3.7_VCC_IO IC3.8_VCC | IC3.9_V_RESET IC3.8_VCC
  Bottom 0.508: X1.1 46.2,47.15 v46.51,46.83
  Bottom 0.61: X2.4 C28.1 | 20.54,4.45 C10.1 21.41,2.78 23.1,2.78 X4.1 | 19.99,4.75 C7.+
+5V  (via drill 0.6)
  Top 0.508: 16.67,38.42 v16.51,38.42
  Top 0.813: v47.15,42.55 20.8,42.55 16.67,38.42
  Bottom 0.254: R7.2 14.19,40.22 13.97,40.01 13.97,38.89 14.45,38.42
  Bottom 0.305: v16.51,38.42 D3.5 14.45,38.42
  Bottom 0.508: IC9.4 46.83,41.59 47.15,41.91 v47.15,42.55 | C23.+ 13.11,35.97 13.97,36.83 13.97,37.94 14.45,38.42
  Bottom 0.813: 11.67,34.29 11.99,33.97 C24.1 | L2.2 11.67,34.29 | 12.06,35.56 C23.+ | 12.06,35.56 11.91,35.4 11.91,34.53 11.67,34.29 | D2.C 11.26,36.37 12.06,35.56
+ACU
  Bottom 0.305: IC6.1 49.83,45.11 49.53,45.4 R6.1
  Bottom 0.508: IC9.3 42.07,41.59 41.83,41.83 41.83,42.23 42.39,42.78 42.39,43.96 D1.C
  Bottom 0.61: 42.7,45.56 X1.3 | 42.7,45.56 42.7,44.46 D1.C | C27.+ 48.03,45.66 R6.1 47.07,45.4 46.43,44.77 44.21,44.77 43.42,45.56 42.7,45.56
+VUSB
  Bottom 0.406: X3.P$1 7.62,36.2 7.86,35.8 7.86,34.29 | 7.86,34.29 7.86,34.05 | L2.1 7.86,34.29
A0  (via drill 0.3)
  Top 0.203: v29,35.75 32.5,35.75 35.96,39.21 v36.83,39.21
  Bottom 0.203: v29,35.75 29,36.62 IC2.3 | 32.62,46.88 32.62,47.12 X1.11 32.54,46.83 32.54,46.28 32.78,46.28 36.19,42.87 36.19,42.15 37.15,41.2 37.86,41.2 37.86,40.24 v36.83,39.21
A1  (via drill 0.3)
  Top 0.203: v31.25,37.75 30.38,37.75 v27.5,40.62
  Bottom 0.203: v31.25,37.75 31,37.5 31,36.75 IC2.7 | v27.5,40.62 27.5,40.88 27.75,41.12 27.75,44.88 30,47.12 X1.13
A2
  Bottom 0.203: IC2.8 31.5,36.62 31.5,36.12 30.5,35.12 28.12,35.12 27.12,36.12 25.88,36.12 24.5,37.5 24.5,44.25 27.38,47.12 X1.15
A3  (via drill 0.3)
  Top 0.203: v32,38.12 32,37.62 31.5,37.12 28.38,37.12 v23.88,41.62
  Bottom 0.203: v32,38.12 32,36.75 IC2.9 | v23.88,41.62 23.88,46.12 24.88,47.12 X1.17
A4  (via drill 0.3)
  Top 0.203: v32.5,35.12 28.75,35.12 v22.62,41.25
  Bottom 0.203: v32.5,35.12 32.5,36.62 IC2.10 | v22.62,41.25 22.62,47 22.5,47.12 X1.19
A5
  Bottom 0.203: IC2.47 26.5,34.62 27,34.62 27.25,34.88 27.25,35.38 26.88,35.75 25.62,35.75 21,40.38 21,46 19.88,47.12 X1.21
ANT  (via drill 1 pad 2)
  Bottom 1: IC5.10 22.57,7.99 v22.54,8.02
ANT_GPS
  Bottom 0.508: IC3.11_RF_IN 19.12,10.21 arc-45 19.37,10.79 arc-45 19.75,10.95 22.18,10.95 arc-45 ANT1.ANT_GPS
AREF
  Bottom 0.305: IC2.4 29.52,38.57 29.84,38.89 C2.1 31.13,40.11 C1.+
D2
  Bottom 0.203: IC2.13 35.12,35.12 35.12,35.72 36.04,36.63 36.04,37.31 35.8,37.54 35.8,39.93 36.59,40.72 36.59,41.2 35.79,42 35.79,42.71 32.7,45.8 31.19,45.8 30.88,46.12 30.88,48.25 27.62,51.5 26.88,51.5 25.75,52.62 25.75,54 25.62,54.12 21.75,54.12 20.62,53 20.62,51.75 20.38,51.5 16.12,51.5 14.88,52.75 X1.26
D3  (via drill 0.3)
  Top 0.203: v40.88,43.5 34.45,43.5 33.23,44.72 32.53,44.72 31.5,45.75 21.25,45.75 v19.75,44.25 | v37,36.25 37.76,36.25 40.88,39.37 v40.88,41.62
  Bottom 0.203: v37,36.25 36,35.25 36,35 35.62,34.62 35.12,34.62 IC2.14 | v40.88,43.5 v40.88,41.62 | v19.75,44.25 18.38,44.25 16.75,45.88 14.12,45.88 13.88,46.12 13.88,53.88 14.62,54.62 16.25,54.62 17.25,53.62 17.25,52.88 X1.24
D4  (via drill 0.3)
  Top 0.203: v34.12,31.38 37.88,31.38 44,37.5 v44,38.5 | v45.75,38.5 45.75,38.75 48.62,41.62 48.62,43.38 46.75,45.25 45.25,45.25 36.12,54.38 36.12,54.62 35.75,55 33.12,55 31.88,53.75 26.88,53.75 v26.25,54.38
  Bottom 0.203: v34.12,31.38 34.12,30.5 34.5,30.12 35,30.12 IC2.23 | v45.75,38.5 v44,38.5 | v26.25,54.38 26,54.38 25.88,54.5 21.5,54.5 19.88,52.88 X1.22
D5  (via drill 0.3, 0.35)
  Top 0.203: v20.62,38.38 16.62,34.38 16.62,31.62 17.75,30.5 17.75,29 26.67,20.08 v29.53,20.08
  Bottom 0.203: v20.62,38.38 20.62,44.38 19,46 19,49.38 22.38,52.75 X1.20 | IC2.24 35,29.5 35,27 34.25,26.25 34.25,23.12 31.21,20.08 v29.53,20.08
D6  (via drill 0.3)
  Top 0.203: v30.75,30.62 21.88,39.5 v21.88,41.62
  Bottom 0.203: v30.75,30.62 31.5,29.88 31.5,28.12 IC2.29 | v21.88,41.62 21.88,45.75 21.5,46.12 21.5,49.38 24.88,52.75 X1.18
D7  (via drill 0.3)
  Top 0.203: v34.38,27.38 38.38,27.38 39.38,26.38 43.12,26.38 49.75,33 49.75,43.5 47.25,46 46.25,46 36.88,55.38 32.62,55.38 v31.62,54.38
  Bottom 0.203: v34.38,27.38 31.25,27.38 31,27.62 31,28 IC2.30 | v31.62,54.38 29,54.38 27.5,52.88 X1.16
D8  (via drill 0.3)
  Top 0.203: v35.88,45.75 32.4,45.75 v31.5,46.73 | v39.5,41.25 39.5,41.01 38.73,40.24 38.73,38.73 38.18,38.18 37.39,38.18 37.11,37.9 36.39,37.9 35.56,37.07 v35.32,37.07
  Bottom 0.203: v35.88,45.75 38.62,45.75 39.93,44.45 39.93,41.68 v39.5,41.25 | v31.5,46.73 31.5,51.25 30,52.75 X1.14 | IC2.11 33,36.75 33,37.12 33.5,37.62 34.76,37.62 v35.32,37.07
D9/ITR  (via drill 0.3, 0.35)
  Top 0.203: v34.38,36.75 34.38,37 35.8,38.42 36.91,38.42 37.15,38.66 37.78,38.66 v38.02,38.89 | v47.55,18.02 50.24,18.02 54.29,22.07 54.29,24.92 57.86,28.5 57.86,38.02 56.12,39.77 56.04,39.85 55.4,40.48 55.4,44.97 54.45,46.2 52.86,46.2 51.99,47.07 51.99,49.13 48.97,52.15 47.78,52.15 46.2,53.74 43.66,53.74 42.07,55.32 v42.07,55.88
  Bottom 0.203: X1.12 32.62,52.75 32.62,54.17 | v34.38,36.75 33.62,36.75 IC2.12 | v38.02,38.89 38.02,39.53 38.26,39.77 38.26,41.35 37.99,41.62 37.28,41.62 36.63,42.27 36.63,42.98 33.5,46.12 33.5,48.5 32.54,49.45 32.54,54.09 32.62,54.17 | IC5.2 47.51,17.98 v47.55,18.02 | 32.62,54.17 32.62,54.77 33.73,55.88 v42.07,55.88
D10/SS  (via drill 0.3)
  Top 0.203: v32.38,31 32.75,31 33,30.75 37.88,30.75 44.38,37.25 44.38,38 48.25,41.88 48.25,43.12 46.5,44.88 45,44.88 v35.5,54.38
  Bottom 0.203: v32.38,31 32.38,29.12 32.5,29 32.5,28.12 IC2.27 | v35.5,54.38 35.5,53.25 35.12,52.88 X1.10
D11/MOSI  (via drill 0.3)
  Top 0.203: v33.25,31.38 33.88,32 37.62,32 v40.12,34.5 | v43.12,34.5 48.5,39.88 48.5,40.88 49,41.38 49,43.62 47,45.62 45.75,45.62 v37,54.38
  Bottom 0.203: v33.25,31.38 33.62,31 33.62,28.12 IC2.25 | v43.12,34.5 v40.12,34.5 | v37,54.38 37,53.38 37.5,52.88 X1.8
D12/MISO  (via drill 0.3)
  Top 0.203: v31.75,30.5 32,30.5 32.12,30.38 38.12,30.38 v45,37.25 | v51.25,37.25 51.25,45.5 v49.62,47.12
  Bottom 0.203: v31.75,30.5 32,30.25 32,28.12 IC2.28 | v51.25,37.25 v45,37.25 | v49.62,47.12 49.62,48.62 46.75,51.5 41.5,51.5 40.25,52.75 X1.6
D13/SCK  (via drill 0.3)
  Top 0.203: v33,29.38 31.94,29.38 31.32,28.75 22.12,28.75 21.49,29.39 | v41.12,54.38 38.5,54.38 35.7,57.18 arc45 30.39,59.38 arc45 23.32,56.45 12.38,45.5 9.5,45.5 6.38,42.38 6.38,37.62 8.38,35.62 v14.38,35.62 | v17.5,33.12 17.75,33.12 21.49,29.39 | v20.84,29.39 21.49,29.39
  Bottom 0.203: v33,29.38 33,28.12 IC2.26 | v41.12,54.38 42.62,52.88 X1.4 | v14.38,35.62 14.38,34.62 14.25,34.5 14.25,33.38 14.5,33.12 v17.5,33.12 | T1.1 19.56,29.39 v20.84,29.39 20.88,29.27 R14.2
D+IN
  Bottom 0.203: 7.2,37.69 X3.P$3
  Bottom 0.254: X3.P$3 8.26,37.31 9.62,38.45 9.9,38.73 11.51,38.73 12.14,39.37 D3.3
D-IN
  Bottom 0.203: 6.84,37.16 X3.P$2 | 8.18,36.67 8.27,36.67 8.32,36.71
  Bottom 0.254: X3.P$2 8.18,36.67 | D3.1 12.22,37.47 11.9,37.47 11.35,38.02 9.91,38.02 8.32,36.71 8.23,36.64 8.04,36.72
GND  (via drill 0.3, 0.6, 3.1 pad 3.5)
  Bottom 0.305: 28.5,29.05 28.52,29.02 IC2.35 28.52,27.25 28.5,27.23
  other vias: 30,57 6.62,16.5 53.38,16.5 1.43,35.24 1.27,25.08 3.33,35.4 4.76,40.01 2.86,20.95 3.57,20.16 4.29,19.45 5,18.65 20.32,12.06 18.26,11.27 19.21,11.91 21.35,12.38 56.04,23.5 40.96,23.97 41.43,36.83 52.86,47.62 44.13,55.24 4.52,44.21 26.99,41.43 55.88,37.15 47.15,27.62 17.46,3.81 15.56,5.87 30.64,39.05 14.92,26.99 26.27,25.96 27.54,21.35 11.43,47.62 12.38,17.46 28.5,26.99 28.73,31.59 35.24,26.35 30.56,21.91 24.53,23.73 26.11,23.1 19.61,33.02 25.24,31.83 31.27,45.09 36.51,44.69 26.83,43.42 25.32,43.74 16.19,45.16 13.57,45.32 19.37,38.02 16.03,54.05 20.88,55.01 33.66,54.37 41.43,47.07 52.78,43.34 49.13,39.93 52.7,40.01 41.59,40.96 46.35,40.88 37.54,28.1 49.05,33.18 39.53,39.37 45.56,43.66 17.3,31.83 19.45,26.19 21.27,19.61 46.83,36.67 28.57,6.43 23.18,4.45 21.27,5.4 32.7,16.03 31.67,6.43 42.78,4.45 50.09,13.49 47.55,15.08 41.04,27.7 44.69,26.51 33.97,32.62 40.56,20.24 30.08,32.23 29.37,43.58 34.77,39.29 22.15,37.07 23.34,39.45 17.38,34.13 15.95,32.23 18.89,34.13 22.62,29.45 15.8,29.05 3.65,29.69 2.22,30.48 12.22,20.48 31.43,33.5 37.31,29.37 40.16,35.48 50.16,49.77 48.58,51.28 24.45,58.74 23.34,55.24 27.23,55.56 35.16,58.74 36.99,58.34 7.3,47.7 7.38,44.53 12.38,40.24 16.75,40.16 33.42,35.32 29.21,33.5 32.46,31.99 29.29,30.96 37.39,26.59 37.94,23.18 43.58,21.67 12.14,7.78 9.53,9.76 3.97,17.78 7.78,19.53 28.1,16.83 46.28,21.59 51.12,21.19 49.13,21.03 48.66,29.92 46.59,31.19 11.27,15.4 20.32,15.24 23.65,21.27 21.75,19.05 21.43,9.6 23.18,9.76 22.38,12.62 23.34,12.06 12.7,36.75 10.87,21.59 23.57,46.99 26.11,46.99 28.65,46.99 26.59,45.09 23.26,43.58 26.75,39.93 31.35,3.65
  pour Bottom: 0,30 arc90 30,0 arc90 60,30 arc90 30,60 arc90
  pour Top: 30,0 arc-90 0,30 arc-90 30,60 arc-90 60,30 arc-90
INT_CS  (via drill 0.3)
  Top 0.203: v41.38,32.12 38,28.75 32.88,28.75 30.5,26.38 28.25,26.38 28,26.62 22.75,26.62 v22.23,27.15
  Bottom 0.203: v41.38,32.12 42.88,32.12 X2.2 | IC2.37 23.89,29.61 22.23,27.94 v22.23,27.15
INT_MISO
  Bottom 0.203: 40.56,27.06 41,26.62 42.88,26.62 X2.7 | 40.56,27.06 36.5,31.12 35.12,31.12 IC2.21 | 40.56,27.06 27.5,14 25.62,14 IC5.13
INT_MOSI  (via drill 0.3)
  Top 0.203: v39.62,27 39.62,29.38 v41.38,31.12
  Bottom 0.203: 41.44,31.19 41.5,31.12 42.88,31.12 X2.3 | 41.44,31.19 40.5,32.12 35.12,32.12 IC2.19 | v39.62,27 30.25,17.62 30,17.62 28.38,16 25.62,16 IC5.14 | v41.38,31.12 41.44,31.19
INT_SCK
  Bottom 0.203: IC5.12 25.6,12 26.05,12 36.54,22.49 45.43,22.49 45.61,22.67 45.61,26.85 43.65,28.8 43.03,28.8 X2.5 42.88,28.88 40.38,28.88 40,29.25 40,30.5 38.88,31.62 35.12,31.62 IC2.20
INT_SS
  Bottom 0.203: IC2.22 35.12,30.62 35.5,30.62 35.88,30.25 35.88,23.88 30,18 25.62,18 IC5.15
MLED  (via drill 0.3)
  Top 0.203: v17.12,30.12 14.38,32.88 13.88,32.88 9.62,28.62 5.12,28.62 3.89,27.39 3.89,21.83 4.84,20.88 8.89,20.88 9.32,21.31 LED3.3 | LED3.3 9.25,22.05 | 9.34,23.56 LED3.4 | LED3.3 9.34,22.23 9.32,22.24 LED3.4 | 9.37,23.63 LED3.4
  Bottom 0.203: v17.12,30.12 26.38,30.12 IC2.38
N$1  (via drill 0.3)
  Top 0.203: v17.87,37.43 12.18,31.74 7.11,31.74 LED4.A
  Bottom 0.203: v17.87,37.43 17.87,38.49 17.6,38.76 17.6,40.63 16.89,41.34 R10.1
N$2  (via drill 0.3)
  Top 0.203: v18.4,38.76 13.96,34.31 7.11,34.31 LED5.A
  Bottom 0.203: v18.4,38.76 18.4,41.07 18.67,41.34 R11.1
N$3  (via drill 0.3)
  Top 0.203: LED6.A 7.11,27.91 9.51,27.91 13.69,32.09 13.87,32.09 14.05,32.27 v14.13,32.23
  Bottom 0.203: v14.13,32.23 R13.1
N$5  (via drill 0.3)
  Top 0.203: LED6.C 5.6,27.91 5.6,27.29 5.96,26.94 9.63,26.94 10.78,28.09 v13.42,28.09
  Bottom 0.203: v13.42,28.09 16.8,28.09 T1.3
N$6
  Bottom 0.508: R2.2 8.33,42.55 SW1.2
N$7  (via drill 0.35)
  Top 0.203: v21.67,23.42 16.83,23.42 13.74,26.5 6.66,26.5 4.45,24.29 4.45,22.62 4.92,22.15 5.91,22.15 LED3.2
  Bottom 0.254: R15.2 20.24,22.2 R8.1 21.65,23.44 v21.67,23.42
N$9  (via drill 0.35)
  Top 0.203: v21.75,22.07 16.75,22.07 12.74,26.07 8.41,26.07 LED3.1
  Bottom 0.203: R15.1 19.79,20.95 21.43,20.95 21.75,21.27 v21.75,22.07
  Bottom 0.254: R9.2 18.73,22.12 R15.1
N$11  (via drill 0.3)
  Top 0.203: LED2.A 5.51,38.14 5,38.14 3.76,39.38 3.74,39.38 3.74,40.87 v3.27,41.34
  Bottom 0.203: R7.1 12.45,41.34 12,41.78 12,42.67 9.42,45.25 6.04,45.25 5.79,45.01 4.9,43.27 v3.27,41.34
N$13  (via drill 0.3)
  Top 0.203: v11.56,43.92 9.6,41.96 7.11,41.96 LED1.A
  Bottom 0.203: v11.56,43.92 12.09,43.92 12.8,43.2 R5.1
N$14  (via drill 0.6)
  Top 0.813: v11.59,25 13.02,23.57 13.02,22.38 17.62,17.78 44.13,17.78 54.13,27.78 v54.13,45.24
  Bottom 0.305: IC6.2 50.48,44.36 51.51,45.4 R6.2
  Bottom 0.61: C22.1 9.85,26.83 | 9.85,26.83 7.54,26.83 7.19,26.48 IC8.1 | 9.85,26.83 11.28,26.83 11.59,26.52 v11.59,25
  Bottom 0.813: v54.13,45.24 52.84,45.24 R6.2 | v11.59,25 13.03,25 C21.+
N$16
  Bottom 0.508: IC9.5 46.83,39.69 47.07,39.45 47.07,38.76 R12.2
RESET  (via drill 0.3, 0.35)
  Top 0.203: v20,36.25 v24.25,32 | v15.38,42.25 14.75,42.25 v12.12,44.88 | v35.24,19.05 31.75,19.05 26.11,24.69 23.89,24.69 23.18,25.4 v23.18,25.72 | v33.81,14.68 37.31,11.19 v37.31,5.64
  Bottom 0.203: v24.25,32 25.12,31.12 26.38,31.12 IC2.40 27.54,31.11 27.54,29.05 23.97,29.05 23.18,28.26 v23.18,25.72 | v20,36.25 20,41.62 19.38,42.25 v15.38,42.25 | v12.12,44.88 10.75,46.25 R1.1 | v35.24,19.05 35.24,16.11 v33.81,14.68 | X4.4 32.62,5 33.26,5.64 v37.31,5.64
  Bottom 0.508: C9.1 9.05,47.39 SW1.1 9.13,46.28 10,46.35 R1.1
RX  (via drill 0.3)
  Top 0.203: v44,41.62 v37.88,35.5 | v43.75,43.62 42.38,43.62 37.75,48.25 19.5,48.25 v18.38,47.12
  Bottom 0.203: v37.88,35.5 37.88,35.25 36.25,33.62 35.12,33.62 IC2.16 | v44,41.62 44,43.38 v43.75,43.62 | v18.38,47.12 17.38,47.12 X1.23
RX_LED  (via drill 0.3)
  Top 0.203: v2.25,34.62 2.5,34.38 5.5,34.38 LED5.C
  Bottom 0.203: v2.25,34.62 2.75,34.62 4.25,33.12 9.62,33.12 10.12,32.62 10.12,31.12 10.25,31 12.88,31 13.5,30.38 15.88,30.38 16.75,31.25 21.62,31.25 21.88,31.5 21.88,34.5 22.5,35.12 26.38,35.12 IC2.48
SCL  (via drill 0.3, 0.35)
  Top 0.203: v51.3,46.85 51.3,45.96 52.01,45.25 v52.01,41.43 52,41.38 52,34.62 43.12,25.75 35.47,25.75 | 28.89,3.38 29.39,3.38 30.27,4.25 34.12,4.25 35,3.38 IC1.4 | 28.89,3.38 28.25,3.38 IC4.4 | v14.88,6.5 27.62,6.5 27.69,6.44 | v28.73,5.39 27.69,6.44 | v27.25,25.88 34.88,25.88 35,25.75 35.47,25.75 | v27.75,12.88 27.75,6.5 27.69,6.44 | v35.48,20.24 35.47,20.26 35.47,25.75 | 28.89,3.38 28.81,3.45 v28.81,3.97
  Bottom 0.203: v51.3,46.85 51.47,47.03 51.74,47.03 52.09,47.38 52.09,49.07 47.03,54.14 44.18,54.14 43.29,55.03 35.29,55.03 34.23,53.96 34.23,51.74 37.6,48.36 37.6,47.21 X1.7 | v52.01,41.43 52.01,40.54 51.83,40.36 IC6.5 | v14.88,6.5 12.62,8.75 12.62,9.38 IC3.17_SCL2 | v27.25,25.88 28.25,25.88 C15.1 R3.1 30.02,26.11 IC2.32 | v27.75,12.88 35.12,20.24 v35.48,20.24 | v28.81,3.97 28.81,5.31 v28.73,5.39
SDA  (via drill 0.3, 0.35)
  Top 0.203: 27.56,4 27.56,3.38 IC4.3 | 27.56,4 28.18,4.62 34.85,4.62 35.65,3.82 35.65,2.85 35.29,2.49 34.85,2.49 34.23,3.11 34.23,3.29 IC1.3 | v26.27,4.45 26.72,4 27.56,4 | v37.75,37.4 36.52,37.4 v30.75,31.62
  Bottom 0.203: IC6.6 51.12,39.62 49.38,37.88 38.23,37.88 v37.75,37.4 38.81,38.46 38.81,41.59 39.53,42.31 39.53,44.29 38.5,45.32 36.35,45.32 36.12,45.09 35.36,45.09 35.08,45.37 X1.9 | v30.75,31.62 30.12,31 30.12,29 30.5,28.62 30.5,28.12 IC2.31 30.52,27.26 30.96,26.83 31.27,26.83 31.43,26.67 R4.1 C17.1 33.07,25.87 33.78,25.16 33.78,23.56 31.25,21.03 29.54,21.03 27.62,19.11 24.18,19.11 23.73,18.67 23.73,15.32 23.34,14.92 23.34,14.05 23.1,13.81 17.46,13.81 13.69,10.05 13.69,9.42 IC3.16_SDA2 13.65,9.39 13.65,8.57 14.84,7.38 20.95,7.38 23.34,5 25.96,5 26.27,4.68 v26.27,4.45
STAT-AKU  (via drill 0.3)
  Top 0.203: v38.67,46.49 37.34,47.83 22.49,47.83 12.8,38.14 7.11,38.14 LED2.C
  Bottom 0.203: v38.67,46.49 38.67,46.23 40.29,44.6 40.29,41.41 41.96,39.74 42.76,39.74 IC9.1
SWC  (via drill 0.3)
  Top 0.203: v25.5,33.75 28,31.25 28,31.12 28.89,30.23 30.12,30.23 30.48,29.88 32.62,29.88 32.75,30 35.88,30 v36.5,29.38 | v36.5,24.75 36.5,22.12 v36.75,21.88
  Bottom 0.203: v25.5,33.75 25.62,33.62 26.38,33.62 IC2.45 | v36.5,24.75 v36.5,29.38 | v36.75,21.88 36.75,19.12 36.88,19 36.88,15.75 27.54,6.42 X4.2
SWD  (via drill 0.3)
  Top 0.203: v38.88,34.12 v34.12,34.12 | v44.5,28.75 v44.5,30.62
  Bottom 0.203: v34.12,34.12 26.5,34.12 IC2.46 | v38.88,34.12 39.62,34.12 39.88,33.88 44.12,33.88 44.38,33.62 44.38,30.75 v44.5,30.62 | v44.5,28.75 44.5,28.5 46,27 46,22.5 44.38,20.88 42.62,20.88 30.08,8.33 X4.3
TX  (via drill 0.3)
  Top 0.203: v36.62,34.88 38.38,34.88 45.25,41.75 47.38,41.75 47.88,42.25 47.88,42.88 46.25,44.5 42.12,44.5 38,48.62 17.25,48.62 v15.75,47.12
  Bottom 0.203: v36.62,34.88 35.88,34.12 35.12,34.12 IC2.15 | v15.75,47.12 14.88,47.12 X1.25
TX_LED  (via drill 0.3)
  Top 0.203: v10.25,18 9.38,18.88 6.21,18.88 3.41,21.67 3.41,27.54 5.5,29.62 5.5,31.75 LED4.C
  Bottom 0.203: v10.25,18 10.25,18.25 10,18.5 10,19.62 13.56,23.19 16.76,23.19 17.3,23.73 17.3,24.64 17.75,25.09 17.75,28.62 16.5,29.88 16.5,30.38 16.88,30.75 25.88,30.75 26,30.62 26.38,30.62 IC2.39
USB_D+  (via drill 0.3)
  Top 0.203: v29.38,27.12 28.38,28.12 20.75,28.12 18.12,30.75 v18.12,31.88 | v15,36.62 15,38.25 v16.12,39.38
  Bottom 0.203: v29.38,27.12 29,27.5 29,28 IC2.34 | v18.12,31.88 18.12,35.5 17,36.62 v15,36.62 | v16.12,39.38 16.12,39.37 D3.4
USB_D-  (via drill 0.3)
  Top 0.203: v18.75,35.5 24.12,30.12 28.12,30.12 28.92,29.33 v29.51,29.33
  Bottom 0.203: v29.51,29.33 29.5,28.62 29.5,28.12 IC2.33 | D3.6 16.78,37.47 v18.75,35.5
VDDA
  Bottom 0.305: IC2.6 30.52,37.98 31.59,39.05 33.02,39.05 33.34,39.37 L1.2 33.44,40.42 C6.1
VDDCORE
  Bottom 0.305: IC2.43 23.08,32.61 C16.1
XIN
  Bottom 0.305: C4.1 25.4,38.51 25.48,38.43 | 25.48,38.43 XT1.2 | IC2.1 26.15,36.63 25.48,37.31 25.48,38.43
XOUT
  Bottom 0.305: IC2.2 28.52,38.38 XT1.1 28.49,40.02 C3.1

### Text on the board
Top: MainBoard | v2.0 RevB
Bottom: v2.0 RevB | MainBoard
tPlace: open | RESET | openCanSat.eu | USB | OFF | uSD card | ON | GPS ANT | Humidity | Pressure
bPlace: ANT | +3V3 | GND | SWC | SWD | RESET